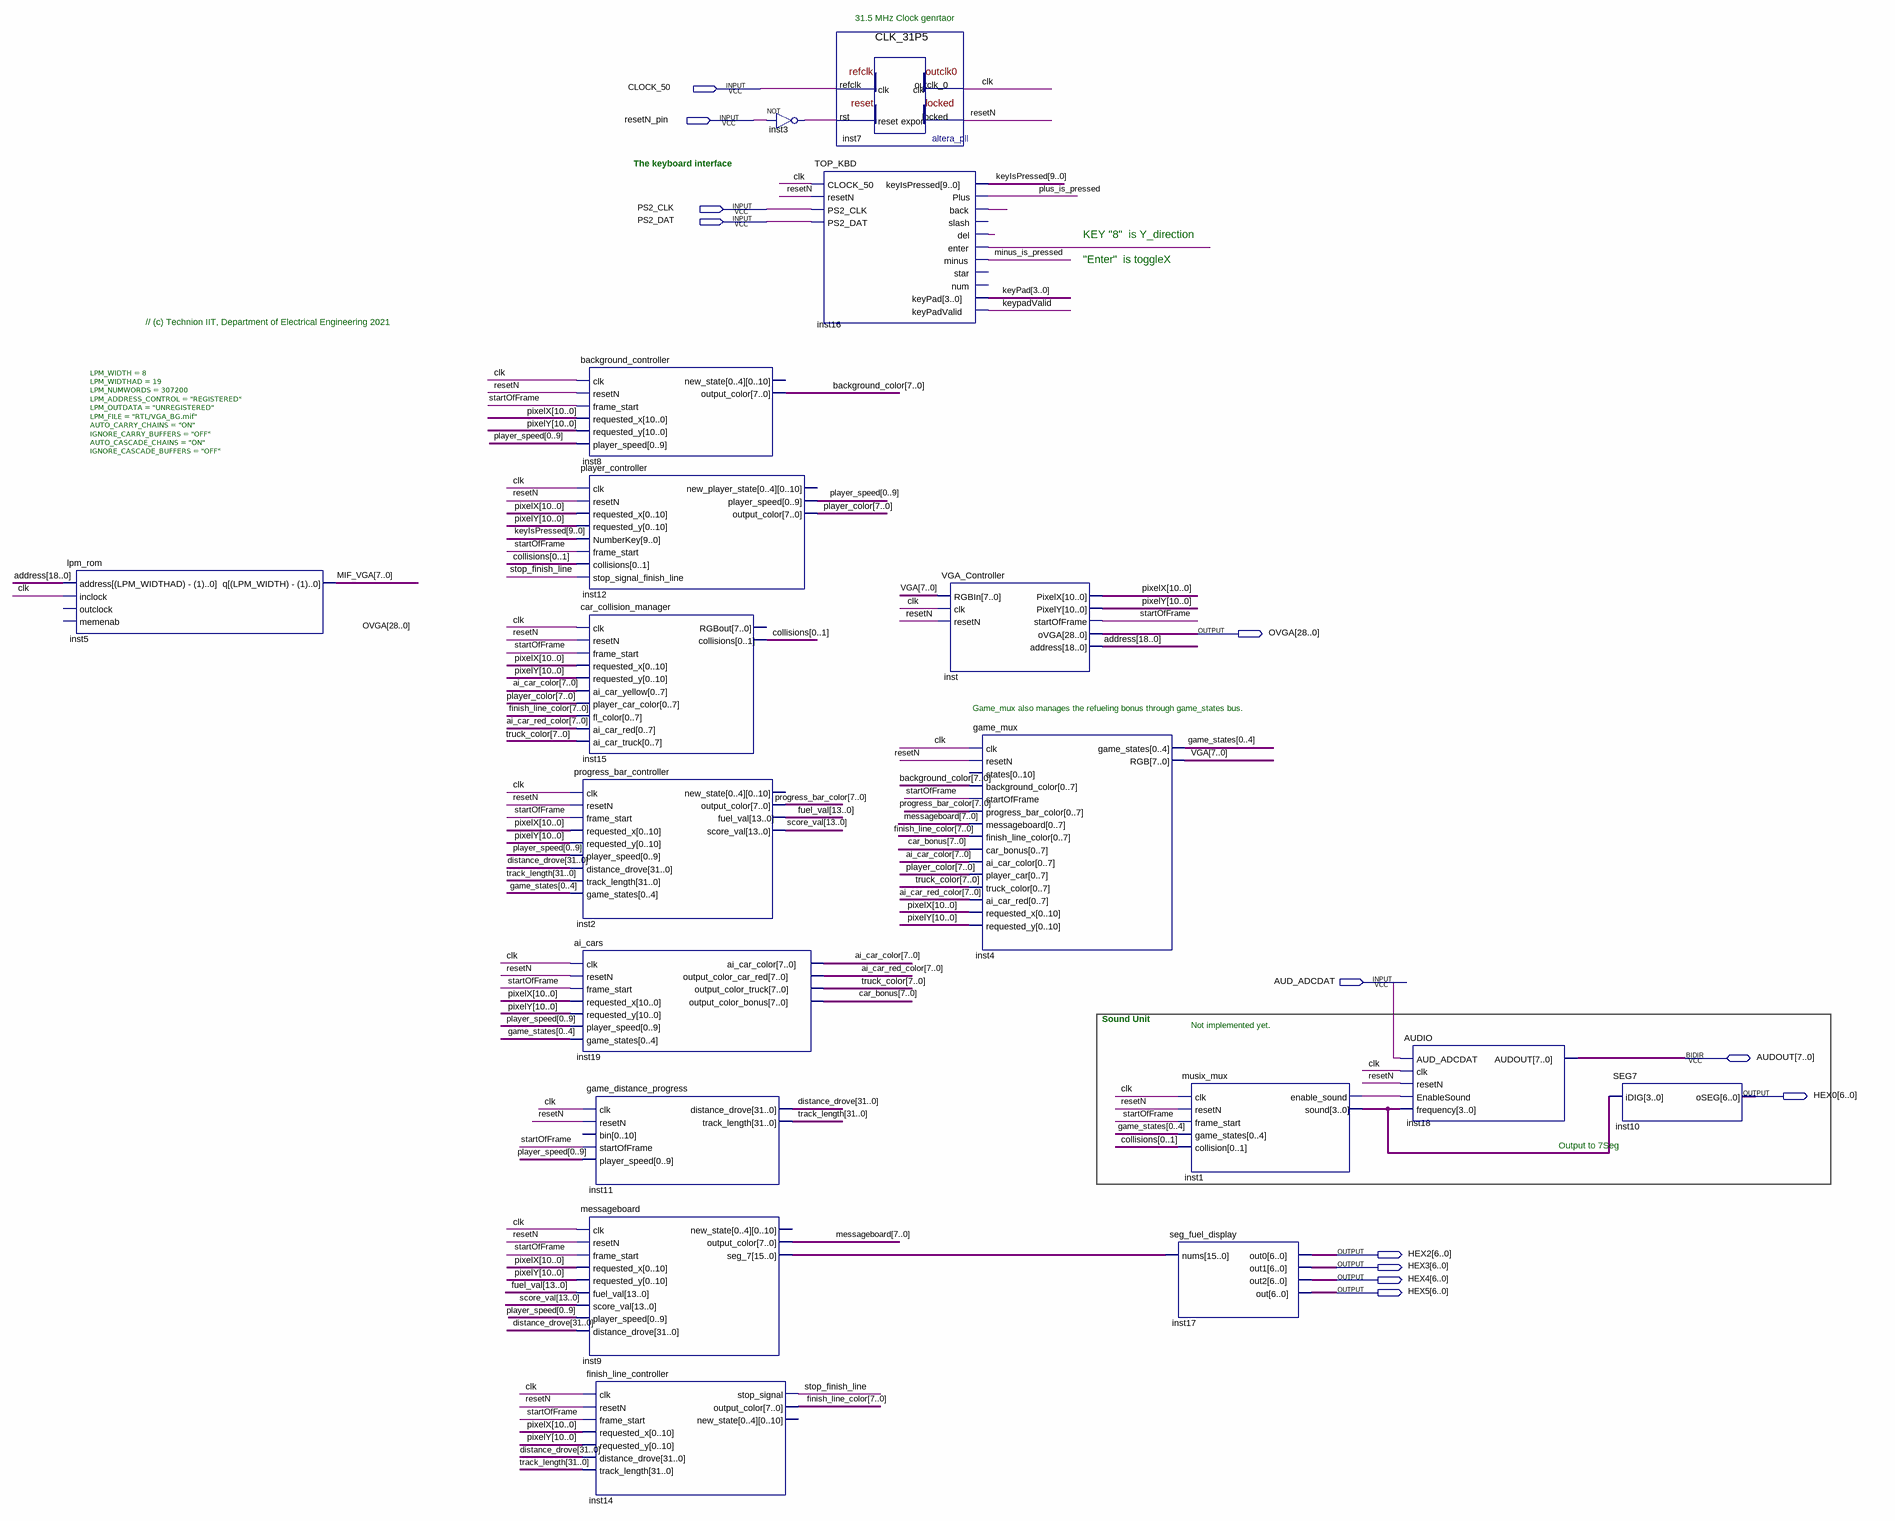
[diagram p0: schematic sheet]
// Quartus schematic Car_Fighter.bdf as structural Verilog: 18 symbols, 12 pins
module Car_Fighter (
  input  CLOCK_50,
  input  resetN_pin,
  input  PS2_CLK,
  input  PS2_DAT,
  input  AUD_ADCDAT,
  inout  [7:0] AUDOUT,
  output [28:0] OVGA,
  output [6:0] HEX0,
  output [6:0] HEX2,
  output [6:0] HEX3,
  output [6:0] HEX4,
  output [6:0] HEX5
);

  wire clk, inst1_enable_sound, inst3_out, inst16_back, inst16_del, inst16_enter, keypadValid,
       minus_is_pressed, plus_is_pressed, resetN, startOfFrame, stop_finish_line;
  wire [1:0] collisions;
  wire [3:0] inst1_sound, keyPad;
  wire [4:0] game_states;
  wire [7:0] ai_car_color, ai_car_red_color, background_color, car_bonus, finish_line_color, messageboard,
       MIF_VGA, player_color, progress_bar_color, truck_color, VGA;
  wire [9:0] keyIsPressed, player_speed;
  wire [10:0] pixelX, pixelY;
  wire [13:0] fuel_val, score_val;
  wire [15:0] inst9_seg_7;
  wire [18:0] address;
  wire [31:0] distance_drove, track_length;

  lpm_rom #(.LPM_WIDTH(8), .LPM_WIDTHAD(19), .LPM_NUMWORDS(307200), .LPM_ADDRESS_CONTROL("REGISTERED"), .LPM_OUTDATA("UNREGISTERED"), .LPM_FILE("RTL/VGA_BG.mif"), .AUTO_CARRY_CHAINS("ON"), .IGNORE_CARRY_BUFFERS("OFF"), .AUTO_CASCADE_CHAINS("ON"), .IGNORE_CASCADE_BUFFERS("OFF")) inst5 (
    .address(address), .inclock(clk), .q(MIF_VGA));  // open: outclock, memenab
  background_controller inst8 (
    .clk(clk), .resetN(resetN), .frame_start(startOfFrame), .requested_x(pixelX), .requested_y(pixelY),
    .player_speed({player_speed[0], player_speed[1], player_speed[2], player_speed[3], player_speed[4], player_speed[5], player_speed[6], player_speed[7], player_speed[8], player_speed[9]}),
    .output_color(background_color));  // open: new_state
  player_controller inst12 (
    .clk(clk), .resetN(resetN), .requested_x(pixelX), .requested_y(pixelY), .NumberKey(keyIsPressed),
    .frame_start(startOfFrame), .collisions({collisions[0], collisions[1]}),
    .stop_signal_finish_line(stop_finish_line),
    .player_speed({player_speed[0], player_speed[1], player_speed[2], player_speed[3], player_speed[4], player_speed[5], player_speed[6], player_speed[7], player_speed[8], player_speed[9]}),
    .output_color(player_color));  // open: new_player_state
  car_collision_manager inst15 (
    .clk(clk), .resetN(resetN), .frame_start(startOfFrame), .requested_x(pixelX), .requested_y(pixelY),
    .ai_car_yellow(ai_car_color), .player_car_color(player_color), .fl_color(finish_line_color),
    .ai_car_red(ai_car_red_color), .ai_car_truck(truck_color), .collisions({collisions[0], collisions[1]}));  // open: RGBout
  progress_bar_controller inst2 (
    .clk(clk), .resetN(resetN), .frame_start(startOfFrame), .requested_x(pixelX), .requested_y(pixelY),
    .player_speed({player_speed[0], player_speed[1], player_speed[2], player_speed[3], player_speed[4], player_speed[5], player_speed[6], player_speed[7], player_speed[8], player_speed[9]}),
    .distance_drove(distance_drove), .track_length(track_length),
    .game_states({game_states[0], game_states[1], game_states[2], game_states[3], game_states[4]}),
    .output_color(progress_bar_color), .fuel_val(fuel_val), .score_val(score_val));  // open: new_state
  ai_cars inst19 (
    .clk(clk), .resetN(resetN), .frame_start(startOfFrame), .requested_x(pixelX), .requested_y(pixelY),
    .player_speed({player_speed[0], player_speed[1], player_speed[2], player_speed[3], player_speed[4], player_speed[5], player_speed[6], player_speed[7], player_speed[8], player_speed[9]}),
    .game_states({game_states[0], game_states[1], game_states[2], game_states[3], game_states[4]}),
    .ai_car_color(ai_car_color), .output_color_car_red(ai_car_red_color), .output_color_truck(truck_color),
    .output_color_bonus(car_bonus));
  game_distance_progress inst11 (
    .clk(clk), .resetN(resetN), .startOfFrame(startOfFrame),
    .player_speed({player_speed[0], player_speed[1], player_speed[2], player_speed[3], player_speed[4], player_speed[5], player_speed[6], player_speed[7], player_speed[8], player_speed[9]}),
    .distance_drove(distance_drove), .track_length(track_length));  // open: bin
  messageboard inst9 (
    .clk(clk), .resetN(resetN), .frame_start(startOfFrame), .requested_x(pixelX), .requested_y(pixelY),
    .fuel_val(fuel_val), .score_val(score_val),
    .player_speed({player_speed[0], player_speed[1], player_speed[2], player_speed[3], player_speed[4], player_speed[5], player_speed[6], player_speed[7], player_speed[8], player_speed[9]}),
    .distance_drove(distance_drove), .output_color(messageboard), .seg_7(inst9_seg_7));  // open: new_state
  finish_line_controller inst14 (
    .clk(clk), .resetN(resetN), .frame_start(startOfFrame), .requested_x(pixelX), .requested_y(pixelY),
    .distance_drove(distance_drove), .track_length(track_length), .stop_signal(stop_finish_line),
    .output_color(finish_line_color));  // open: new_state
  not inst3 (inst3_out, resetN_pin);
  CLK_31P5 inst7 (.refclk(CLOCK_50), .rst(inst3_out), .outclk_0(clk), .locked(resetN));
  TOP_KBD inst16 (
    .CLOCK_50(clk), .resetN(resetN), .PS2_CLK(PS2_CLK), .PS2_DAT(PS2_DAT), .keyIsPressed(keyIsPressed),
    .Plus(plus_is_pressed), .back(inst16_back), .del(inst16_del), .enter(inst16_enter),
    .minus(minus_is_pressed), .keyPad(keyPad), .keyPadValid(keypadValid));  // open: slash, star, num
  VGA_Controller inst (
    .RGBIn(VGA), .clk(clk), .resetN(resetN), .PixelX(pixelX), .PixelY(pixelY), .startOfFrame(startOfFrame),
    .oVGA(OVGA), .address(address));
  game_mux inst4 (
    .clk(clk), .resetN(resetN), .background_color(background_color), .startOfFrame(startOfFrame),
    .progress_bar_color(progress_bar_color), .messageboard(messageboard),
    .finish_line_color(finish_line_color), .car_bonus(car_bonus), .ai_car_color(ai_car_color),
    .player_car(player_color), .truck_color(truck_color), .ai_car_red(ai_car_red_color),
    .requested_x(pixelX), .requested_y(pixelY),
    .game_states({game_states[0], game_states[1], game_states[2], game_states[3], game_states[4]}), .RGB(VGA));  // open: states
  musix_mux inst1 (
    .clk(clk), .resetN(resetN), .frame_start(startOfFrame),
    .game_states({game_states[0], game_states[1], game_states[2], game_states[3], game_states[4]}),
    .collision({collisions[0], collisions[1]}), .enable_sound(inst1_enable_sound), .sound(inst1_sound));
  seg_fuel_display inst17 (.nums(inst9_seg_7), .out0(HEX2), .out1(HEX3), .out2(HEX4), .out(HEX5));
  AUDIO inst18 (
    .AUD_ADCDAT(AUD_ADCDAT), .clk(clk), .resetN(resetN), .EnableSound(inst1_enable_sound),
    .frequency(inst1_sound), .AUDOUT(AUDOUT));
  SEG7 inst10 (.iDIG(inst1_sound), .oSEG(HEX0));

  // Notes on the sheet:
  //   31.5 MHz Clock genrtaor
  //   The keyboard interface
  //   KEY "8"  is Y_direction
  //   "Enter"  is toggleX
  //   // (c) Technion IIT, Department of Electrical Engineering 2021
  //   Game_mux also manages the refueling bonus through game_states bus.
  //   Sound Unit
  //   Not implemented yet.
  //   Output to 7Seg
endmodule
